# Altium project buzzer.PrjPcb
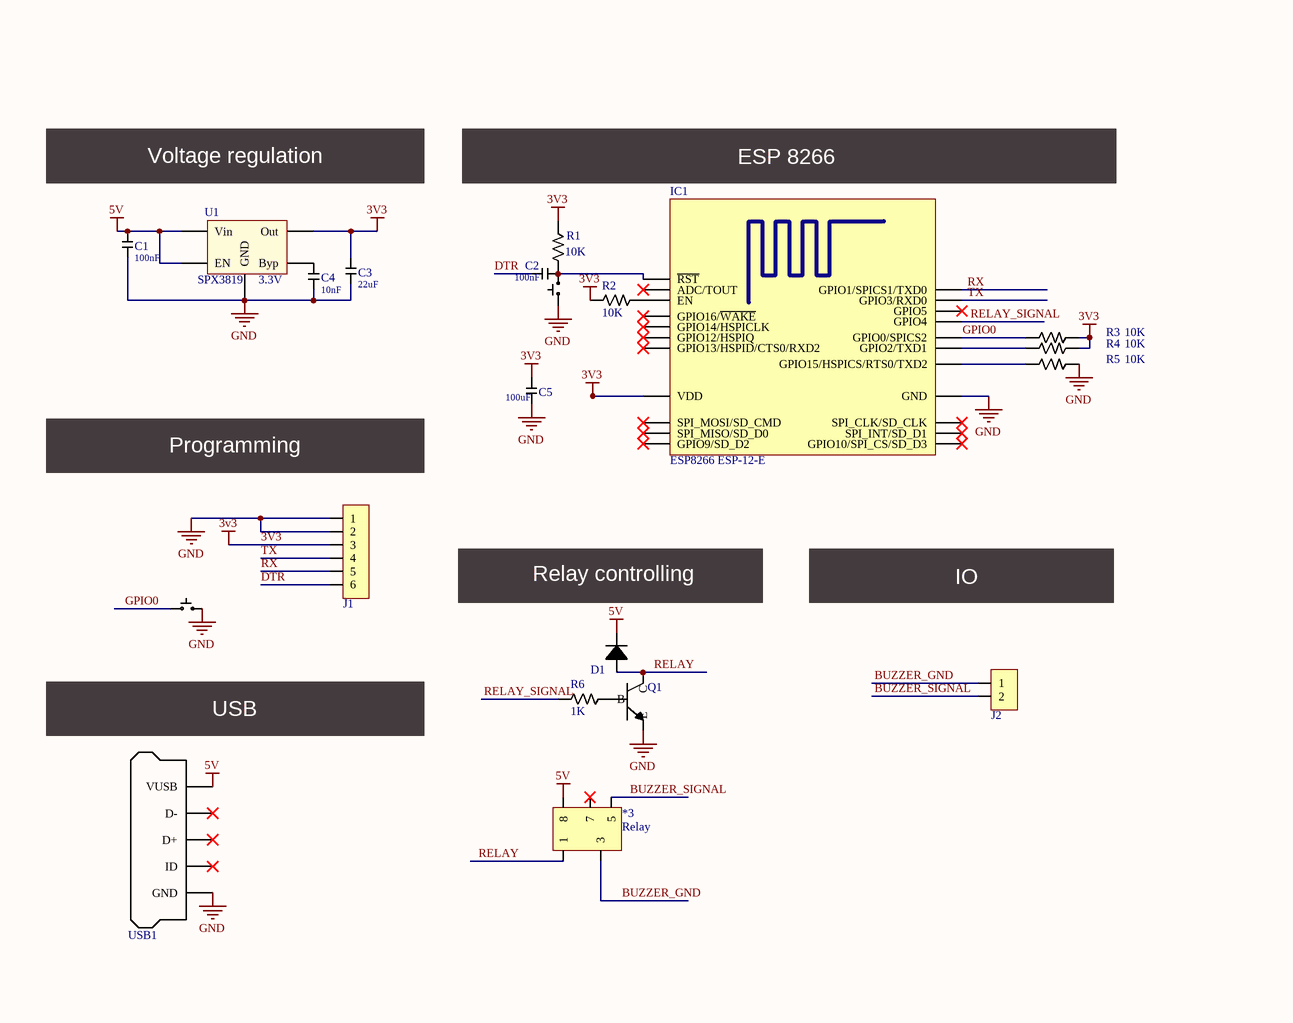
[diagram p0: buzzer.SchDoc]
1 sheet, 21 parts. Net scope: global (net labels, ports and power ports of the same name join across sheets).
Board file: buzzer.PcbDoc

## Sheet buzzer.SchDoc
size A

### Parts
*1  Push button  [TACTILE SWITCH]  (value not drawn)
*2  Push button  [TACTILE SWITCH]  (value not drawn)
*3  Relay  [RELAY IMC03GR SMD]
C1  100nF  [CAP-0603-GEN]
C2  100nF  [CAP-0603-GEN]
C3  22uF  [CAP-0603-GEN]
C4  10nF  [CAP-0603-GEN]
C5  100uF  [CAP-1206-GEN]
D1  Diode  [DIODE 0603]  (value not drawn)
IC1  ESP8266 ESP-12-E  [ESP8266 ESP-12-E]
J1  Connector 1x6  [PINHEADER 1x6 2.54]  (value not drawn)
J2  Connector 1x2  [Screw terminal 5mm]  (value not drawn)
Q1  (no value)  [SOT23-3]
R1  10K  [RESISTOR 0603]
R2  10K  [RESISTOR 0603]
R3  10K  [RESISTOR 0603]
R4  10K  [RESISTOR 0603]
R5  10K  [RESISTOR 0603]
R6  1K  [RESISTOR 0603]
U1  3.3V  [SOT23-5]
USB1  USB connector  [USB MICRO-B MOLEX SMD]  (value not drawn)

### Nets
3V3: C3.2 C5.2 IC1.8(VDD) J1.3 R1.2 R2.1 R3.2 R4.2 U1.5(Out)
5V: *3.8 C1.2 D1.2(Cathode) U1.1(Vin) U1.3(EN) USB1.1(VUSB)
GND: *1.1 *2.2 C1.1 C3.1 C4.1 C5.1 IC1.15(GND) J1.1 J1.2 Q1.2(E) R5.2 U1.2(GND) USB1.5(GND)
BUZZER_GND: *3.3 J2.1
BUZZER_SIGNAL: *3.5 J2.2
DTR: C2.2 J1.6
GPIO0: *2.1 IC1.18(GPIO0/SPICS2) R3.1
RELAY: *3.1 D1.1(Anode) Q1.3(C)
RELAY_SIGNAL: IC1.19(GPIO4) R6.1
RX: IC1.22(GPIO1/SPICS1/TXD0) J1.5
TX: IC1.21(GPIO3/RXD0) J1.4
Net*1_2: *1.2 C2.1 IC1.1(~{RST}) R1.1
NetC4_2: C4.2 U1.4(Byp)
NetIC1_3: IC1.3(EN) R2.2
NetIC1_16: IC1.16(GPIO15/HSPICS/RTS0/TXD2) R5.1
NetIC1_17: IC1.17(GPIO2/TXD1) R4.1
NetQ1_1: Q1.1(B) R6.2

Not connected (* = marked no-connect by the designer): *3 7*; IC1 2(ADC/TOUT)* 4(GPIO16/~{WAKE})* 5(GPIO14/HSPICLK)* 6(GPIO12/HSPIQ)* 7(GPIO13/HSPID/CTS0/RXD2)* 9(SPI_MOSI/SD_CMD)* 10(SPI_MISO/SD_D0)* 11(GPIO9/SD_D2)* 12(GPIO10/SPI_CS/SD_D3)* 13(SPI_INT/SD_D1)* 14(SPI_CLK/SD_CLK)* 20(GPIO5)*; USB1 2(D-)* 3(D+)* 4(ID)*

### Notes on the sheet
- Voltage regulation
- ESP 8266
- Programming
- Relay controlling
- IO
- USB

### Library data of the parts
C1-C5 = Capacitor
  C1 C2: Value: 100nF
  C3: Value: 22uF
  C4: Value: 10nF
  C5: Value: 100uF
J1 = Connector 1x6: Single row six pin header
J2 = Connector 1x2: Single row two pin header
Q1 = Transistor NPN
R1-R6 = Resistor
  R1-R5: Value: 10K
  R6: Value: 1K
U1 = SPX3819: Name: SPX3819; Datasheet: https://www.exar.com/common/content/document.ashx?id=615